# EAGLE schematic LED Sign Board (EAGLE 7.2.0)
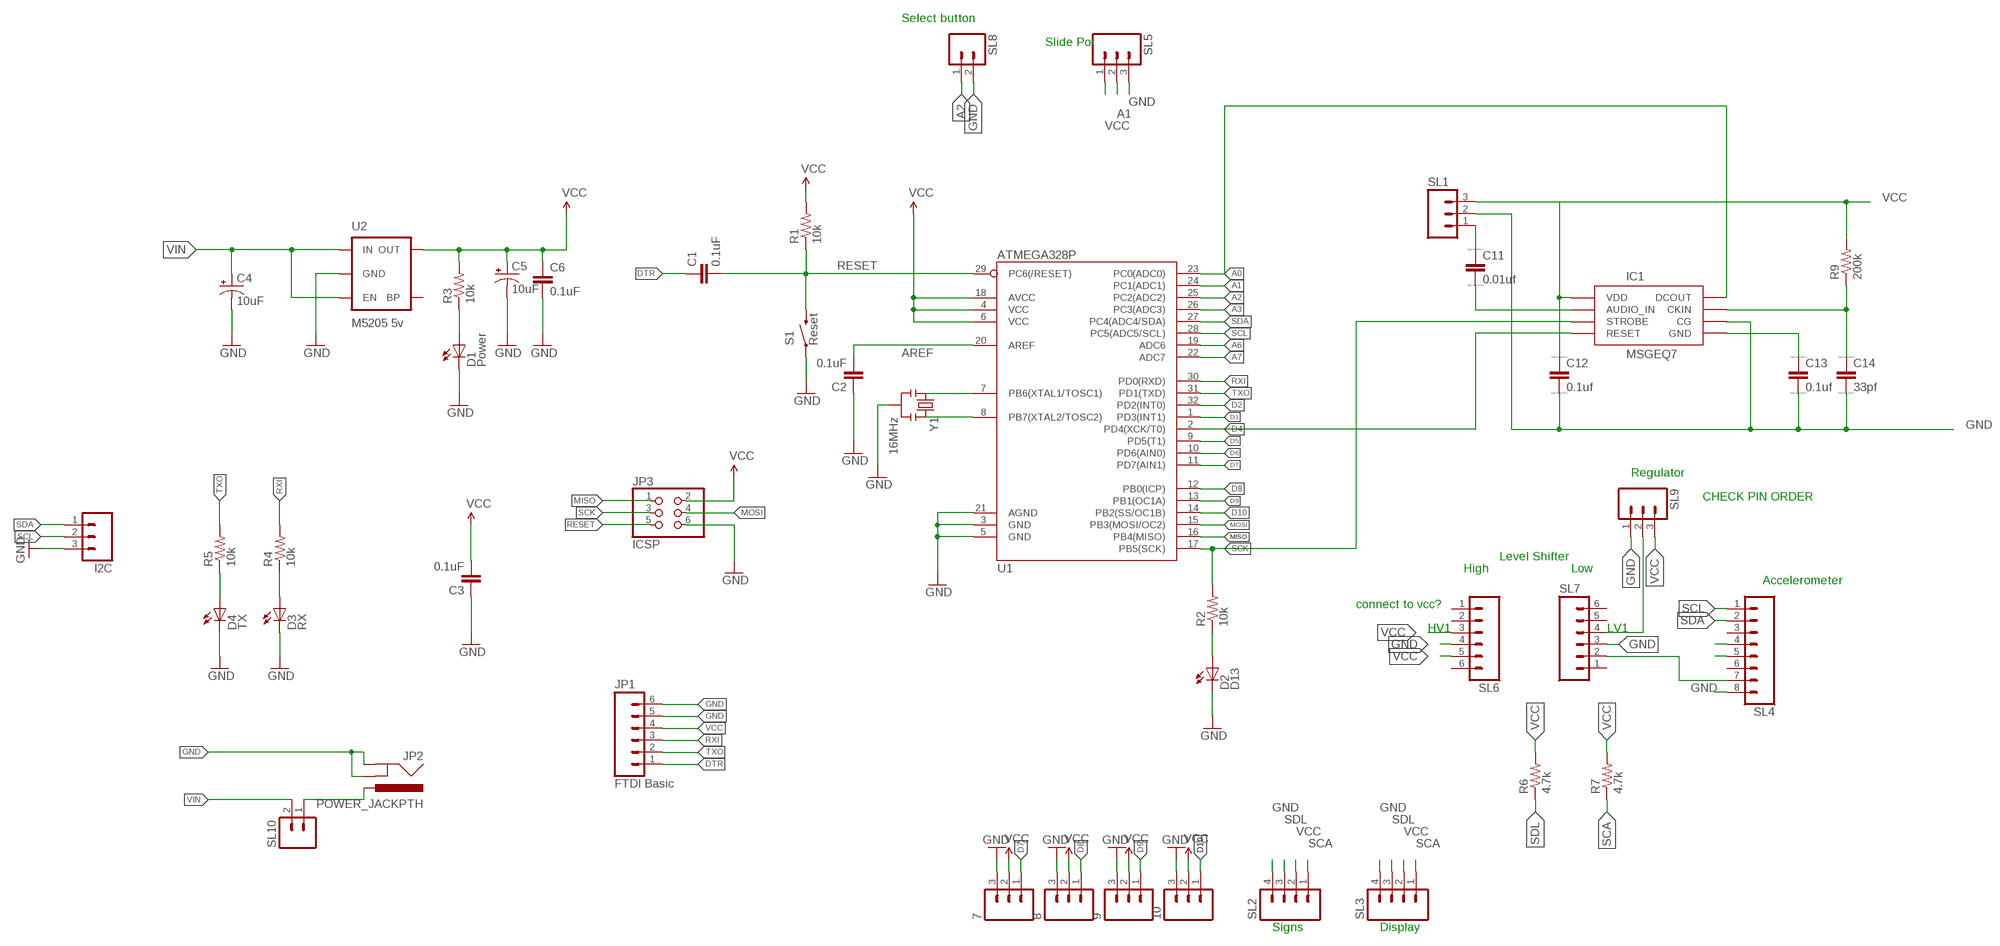
[diagram p0: schematic, sheet 1]

## Parts
7  M03PTH  [1X03]
8  M03PTH  [1X03]
9  M03PTH  [1X03]
10  M03PTH  [1X03]
C1  0.1uF  CAP0603-CAP  [0603-CAP]
C2  0.1uF  CAP0603-CAP  [0603-CAP]
C3  0.1uF  CAP0603-CAP  [0603-CAP]
C4  10uF  CAP_POL1206  [EIA3216]
C5  10uF  CAP_POL1206  [EIA3216]
C6  0.1uF  CAP0603-CAP  [0603-CAP]
C11  0.01uf  CC0201  [C0201]
C12  0.1uf  CC0201  [C0201]
C13  0.1uf  CC0201  [C0201]
C14  33pf  CC0201  [C0201]
D1  Power  LED-RED0603  [LED-0603]
D2  D13  LED-RED0603  [LED-0603]
D3  RX  LED-GREEN0603  [LED-0603]
D4  TX  LED-RED0603  [LED-0603]
I2C  M03PTH  [1X03]
IC1  MSGEQ7DIL  [DIL-08]
JP1  FTDI Basic  M06SIP  [1X06]
JP2  POWER_JACKPTH  [POWER_JACK_PTH]
JP3  ICSP  PINHD-2X3  [2X03]
R1  10k  RESISTOR0603-RES  [0603-RES]
R2  10k  RESISTOR0603-RES  [0603-RES]
R3  10k  RESISTOR0603-RES  [0603-RES]
R4  10k  RESISTOR0603-RES  [0603-RES]
R5  10k  RESISTOR0603-RES  [0603-RES]
R6  4.7k  RESISTOR1206  [1206]
R7  4.7k  RESISTOR1206  [1206]
R9  200k  RESISTOR1206  [1206]
S1  Reset  SWITCH-MOMENTARY-2SMD  [TACTILE_SWITCH_SMD]
SL1  M03  [03P]
SL2  M04  [04P]
SL3  M04  [04P]
SL4  M08  [08P]
SL5  M03  [03P]
SL6  M06  [06P]
SL7  M06  [06P]
SL8  M02  [02P]
SL9  M03  [03P]
SL10  M02  [02P]
U1  ATMEGA328P  ATMEGA328_SMT  [TQFP32-08]
U2  M5205 5v  MIC52055V  [SOT23-5]
Y1  16MHz  RESONATOR16MHZ  [RESONATOR-SMD]

## Nets
A0: IC1.3(DCOUT) U1.23(PC0(ADC0))
A1: SL5.2 U1.24(PC1(ADC1))
A2: SL8.1 U1.25(PC2(ADC2))
A3: U1.26(PC3(ADC3))
A6: U1.19(ADC6)
A7: U1.22(ADC7)
AREF: C2.2 U1.20(AREF)
D2: U1.32(PD2(INT0))
D3: U1.1(PD3(INT1))
D4: IC1.7(RESET) U1.2(PD4(XCK/T0))
D5: U1.9(PD5(T1))
D6: U1.10(PD6(AIN0))
D7: 7.1 U1.11(PD7(AIN1))
D8: 8.1 U1.12(PB0(ICP))
D9: 9.1 U1.13(PB1(OC1A))
D10: 10.1 U1.14(PB2(SS/OC1B))
DTR: C1.1 JP1.1
GND: 7.3 8.3 9.3 10.3 C2.1 C3.1 C4.C(-) C5.C(-) C6.2 C12.2 C13.2 C14.2 D1.C D2.C D3.C D4.C I2C.3 IC1.6(CG) JP1.5 JP1.6 JP2.GND JP2.GNDBREAK JP3.6 S1.1 SL1.2 SL2.4 SL3.4 SL4.8 SL5.3 SL6.4 SL7.3 SL7.4 SL8.2 SL9.1 SL9.2 U1.3(GND) U1.5(GND) U1.21(AGND) U2.2(GND) Y1.2
MISO: JP3.1 U1.16(PB4(MISO))
MOSI: JP3.4 U1.15(PB3(MOSI/OC2))
N$1: U1.7(PB6(XTAL1/TOSC1)) Y1.1
N$2: U1.8(PB7(XTAL2/TOSC2)) Y1.3
N$3: D1.A R3.1
N$4: D2.A R2.1
N$5: D3.A R4.1
N$6: D4.A R5.1
N$7: SL4.7 SL7.2
N$8: JP2.PWR SL10.1
N$9: C11.1 SL1.1
N$10: C11.2 IC1.5(AUDIO_IN)
N$11: C13.1 IC1.2(GND)
N$12: C14.1 IC1.8(CKIN) R9.1
N$14: SL4.5
N$15: SL4.4
RESET: C1.2 JP3.5 R1.1 S1.3 U1.29(PC6(/RESET))
RXI: JP1.3 R4.2 U1.30(PD0(RXD))
SCA: R7.1 SL2.1 SL3.1
SCK: IC1.4(STROBE) JP3.3 R2.2 U1.17(PB5(SCK))
SCL: I2C.2 SL4.1 U1.28(PC5(ADC5/SCL))
SDA: I2C.1 SL4.2 U1.27(PC4(ADC4/SDA))
SDL: R6.1 SL2.3 SL3.3
TXO: JP1.2 R5.2 U1.31(PD1(TXD))
VCC: 7.2 8.2 9.2 10.2 C3.2 C5.A(+) C6.1 C12.1 IC1.1(VDD) JP1.4 JP3.2 R1.2 R3.2 R6.2 R7.2 R9.2 SL1.3 SL2.2 SL3.2 SL5.1 SL6.3 SL6.5 SL9.3 U1.4(VCC) U1.6(VCC) U1.18(AVCC) U2.5(OUT)
VIN: C4.A(+) SL10.2 U2.1(IN) U2.3(EN)
Unconnected: SL4.3 SL4.6 SL6.1 SL6.2 SL6.6 SL7.1 SL7.5 SL7.6 U2.4(BP)

## Notes on the sheet
- Select button
- Slide Pot
- Regulator
- CHECK PIN ORDER
- Level Shifter
- High | Low
- Accelerometer
- connect to vcc?
- HV1 | LV1
- Signs | Display

## Library data of the parts
7-10 I2C = SparkFun-Connectors:M03: Header 3 Standard 3-pin 0.1" header. Use with straight break away headers (SKU : PRT-00116), right angle break away headers (PRT-00553), swiss pins (PRT-00743), machine pins (PRT-00117), and female headers (PRT-00115). Molex polarized connector foot print use with SKU : PRT-08232 with associated crimp pins and housings.
C1-C3 C6 = SparkFun-Passives:CAP: Capacitor Standard 0603 ceramic capacitor, and 0.1" leaded capacitor.
C4 C5 = SparkFun-Passives:CAP_POL: Capacitor Polarized These are standard SMD and PTH capacitors. Normally 10uF, 47uF, and 100uF in electrolytic and tantalum varieties. Always verify the external diameter of the through hole cap, it varies with capacity, voltage, and manufacturer. The EIA devices should be standard.
C11-C14 = eagle-ltspice:C: CAPACITOR, European symbol; SPICEMODEL: NONE; SPICEPREFIX: C
D1 D2 D4 = SparkFun-LED:LED-RED: Assorted Red LEDs LilyPad 1206- DIO-09912 1206- DIO-00809 0603- DIO-00819; PROD_ID: DIO-00819; VALUE: RED
D3 = SparkFun-LED:LED-GREEN: Various green LEDs Green LEDs used in SFE Production 0603- DIO-00821 LARGE- DIO-00862 LILYPAD- DIO-09910; PROD_ID: DIO-00821; VALUE: GREEN
IC1 = SparkFun-AnalogIC:MSGEQ7: 7-band graphic equalizer
JP1 = SparkFun-Connectors:M06: Header 6 Standard 6-pin 0.1" header. Use with straight break away headers (SKU : PRT-00116), right angle break away headers (PRT-00553), swiss pins (PRT-00743), machine pins (PRT-00117), and female headers (PRT-00115). Molex polarized connector foot print use with SKU : PRT-08094 with associated crimp pins and housings. NOTES ON THE VARIANTS LOCK and LOCK_LONGPADS... This footprint was designed to help hold the alignment of a through-hole component (i.e. 6-pin header) while soldering it into place. You may notice that each hole has been shifted either up or down by 0.005 of an inch from it's more standard position (which is a perfectly straight line). This slight alteration caused the pins (the squares in the middle) to touch the edges of the holes. Because they are alternating, it causes a "brace" to hold the component in place. 0.005 has proven to be the perfect amount of "off-center" position when using our standard breakaway headers. Although looks a little odd when you look at the bare footprint, once you have a header in there, the alteration is very hard to notice. Also,if you push a header all the way into place, it is covered up entirely on the bottom side. This idea of altering the position of holes to aid alignment will be further integrated into the Sparkfun Library for other footprints. It can help hold any component with 3 or more connection pins.
JP2 = SparkFun-Connectors:POWER_JACK: Power Jack This is the standard 5.5mm barrel jack for power. The PTH is the most common, proven, reliable, footprint. The Slot footprint only works if the mill layer is transmitted to the PCB fab house so be warned. Mating wall wart : TOL-00298 (and others); PROD_ID: CONN-08197
JP3 = SparkFun-Connectors:PINHD-2X3: PIN HEADER
R1-R5 = SparkFun-Passives:RESISTOR: Resistor Basic schematic elements and footprints for 0603, 1206, and PTH resistors.
R6 R7 R9 = SparkFun-Resistors:RESISTOR: Resistor Basic schematic elements and footprints for 0603, 1206, and PTH resistors.
S1 = SparkFun-Electromechanical:SWITCH-MOMENTARY-2: Various NO switches- pushbuttons, reed, etc; PROD_ID: SWCH-08247
SL1 SL5 SL9 = con-amp-quick:M03: AMP QUICK CONNECTOR; OC_FARNELL: unknown; OC_NEWARK: unknown
SL2 SL3 = con-amp-quick:M04: AMP QUICK CONNECTOR; OC_FARNELL: unknown; OC_NEWARK: unknown
SL4 = con-amp-quick:M08: AMP QUICK CONNECTOR; OC_FARNELL: unknown; OC_NEWARK: unknown
SL6 SL7 = con-amp-quick:M06: AMP QUICK CONNECTOR; OC_FARNELL: unknown; OC_NEWARK: unknown
SL8 SL10 = con-amp-quick:M02: AMP QUICK CONNECTOR; OC_FARNELL: unknown; OC_NEWARK: unknown
U1 = SparkFun-DigitalIC:ATMEGA328_SMT: 32-Pin Atmega328 part Commonly used on Arduino compatible boards Available in QFP and QFN packages TQFP is IC-09069 QFN is non-stock; PROD_ID: IC-09069
U2 = SparkFun-PowerIC:MIC5205: MIC5205 150mA vreg 3.3V - VREG-00822 5V - VREG-00823; PROD_ID: VREG-00823
Y1 = SparkFun-FreqCtrl:RESONATOR: Resonator Small SMD resonator. Used, eg, on the Arduino Pro/ Pro Mini boards. 8MHz- XTAL-08895 16MHz- XTAL-08900; PROD_ID: XTAL-08900